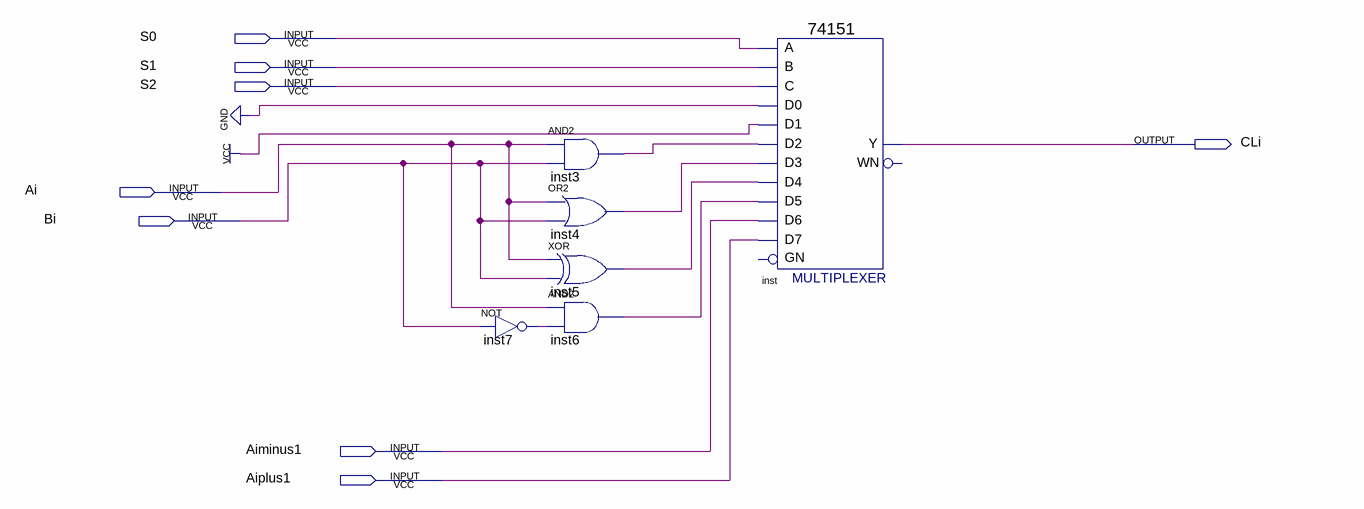
[diagram p0: schematic sheet]
// Quartus schematic LogicCircuit!.bdf as structural Verilog: 6 symbols, 8 pins
module \LogicCircuit!  (
  input  S0,
  input  S1,
  input  S2,
  input  Ai,
  input  Bi,
  input  Aiminus1,
  input  Aiplus1,
  output CLi
);

  wire inst3_out, inst4_out, inst5_out, inst6_out, inst7_out;

  not inst7 (inst7_out, Bi);
  and inst3 (inst3_out, Ai, Bi);
  or inst4 (inst4_out, Ai, Bi);
  xor inst5 (inst5_out, Ai, Bi);
  and inst6 (inst6_out, Ai, inst7_out);
  \74151  inst (
    .C(S2), .B(S1), .A(S0), .D5(inst6_out), .D0(1'b0), .D1(1'b1), .D4(inst5_out), .D3(inst4_out),
    .D2(inst3_out), .D6(Aiminus1), .D7(Aiplus1), .Y(CLi));  // open: GN, WN
endmodule
